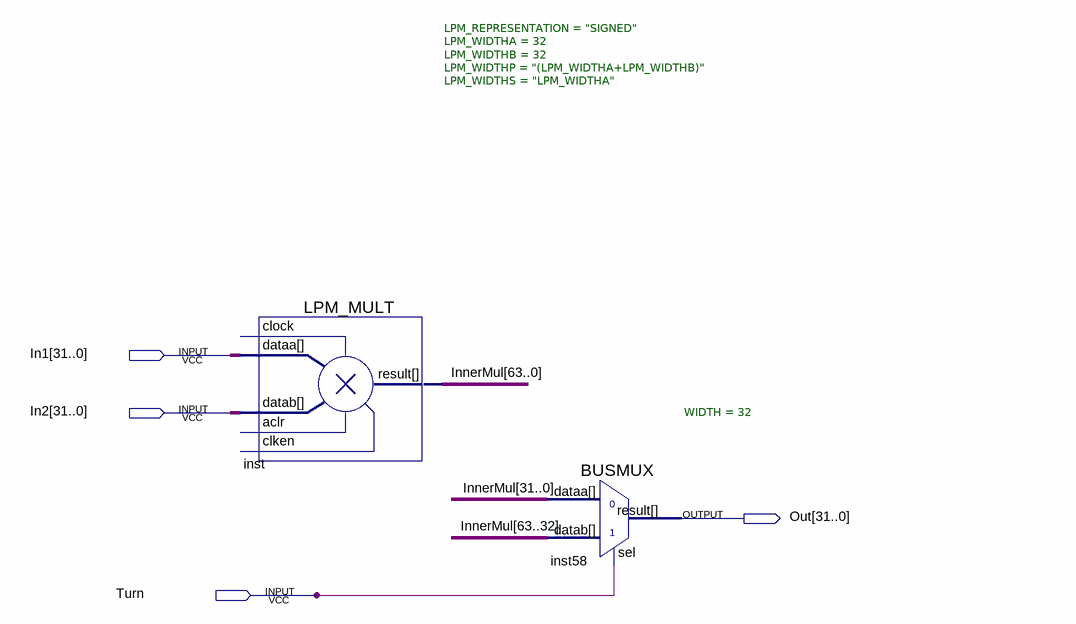
[diagram p0: schematic sheet]
// Quartus schematic Multiplier.bdf as structural Verilog: 2 symbols, 4 pins
module Multiplier (
  input  [31:0] In1,
  input  [31:0] In2,
  input  Turn,
  output [31:0] Out
);

  wire [63:0] InnerMul;

  LPM_MULT #(.LPM_REPRESENTATION("SIGNED"), .LPM_WIDTHA(32), .LPM_WIDTHB(32), .LPM_WIDTHP("(LPM_WIDTHA+LPM_WIDTHB)"), .LPM_WIDTHS("LPM_WIDTHA")) inst (
    .dataa(In1), .datab(In2), .result(InnerMul));  // open: clock, aclr, clken
  BUSMUX #(.WIDTH(32)) inst58 (.datab(InnerMul[63:32]), .sel(Turn), .dataa(InnerMul[31:0]), .result(Out));
endmodule
